# Altium project УШЯИ 687253.017 Э3.PrjPcb
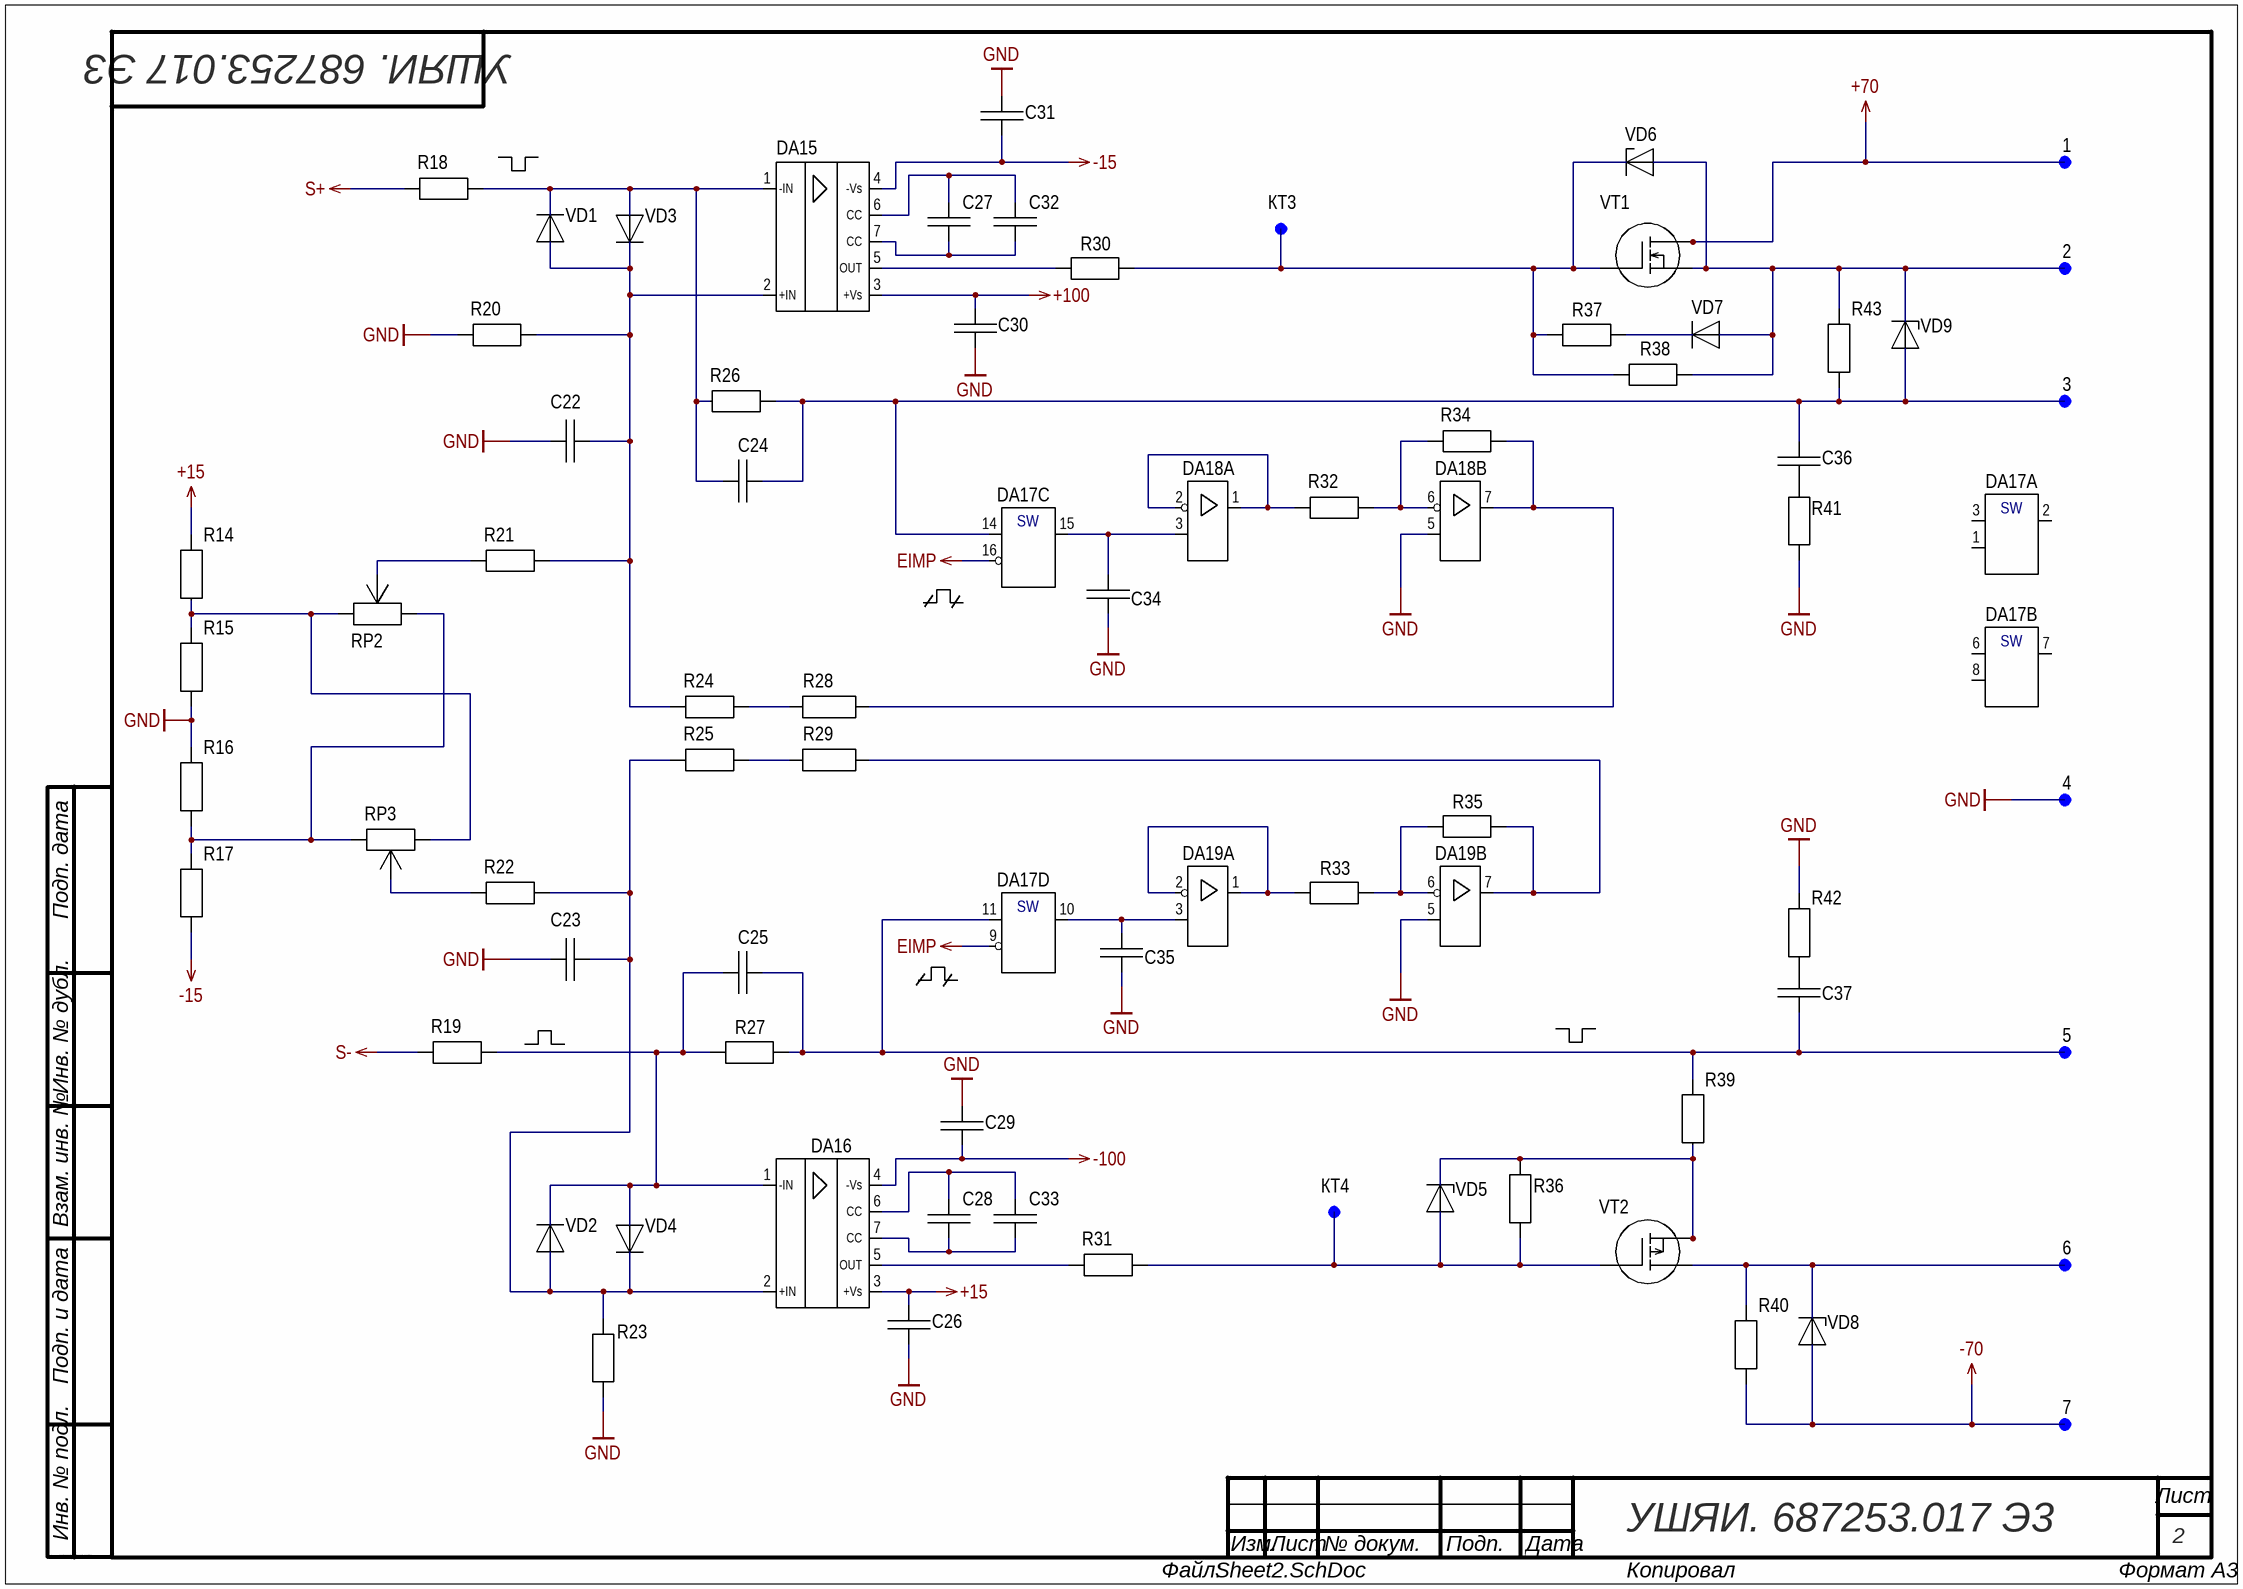
[diagram p0: Sheet2.SchDoc]
Вид_документа_SCH: Схема электрическая принципиальная; Наименование1: Плата; Обозначение_Код: УШЯИ. 687253.017 Э3; Характер_работы: Согл.; п_Доп_графа_Р: Голод; п_Пров_Р: Лисенков; п_Разраб_Р: Сидорик; п_Утв_Р: Грицев
2 sheets, 143 parts. Net scope: global (net labels, ports and power ports of the same name join across sheets).
Board files: PCB1.PcbDoc, PCB2.PcbDoc
Sheets:
  Sheet2.SchDoc
  Sheet3.SchDoc

## Sheet Sheet2.SchDoc
size 420 x 297 mm; SheetNumber: 2; SheetTotal: 3

### Parts
1  OTV  (value not drawn)
2  OTV  (value not drawn)
3  OTV  (value not drawn)
4  OTV  (value not drawn)
5  OTV  (value not drawn)
6  OTV  (value not drawn)
7  OTV  (value not drawn)
C22  2220-X7R-250 В-1 мкФ +-10%  [CAP: 2220]  (value not drawn)
C23  2220-X7R-250 В-1 мкФ +-10%  [CAP: 2220]  (value not drawn)
C24  0805-C0G-250 В-10 пФ +-5%  [CAP: 0805]  (value not drawn)
C25  0805-C0G-250 В-10 пФ +-5%  [CAP: 0805]  (value not drawn)
C26  0805-X7R-25 В-1 мкФ +-10%  [CAP: 0805]  (value not drawn)
C27  0805-C0G-250 В-10 пФ +-5%  [CAP: 0805]  (value not drawn)
C28  0805-C0G-250 В-10 пФ +-5%  [CAP: 0805]  (value not drawn)
C29  2220-X7R-250 В-1 мкФ +-10%  [CAP: 2220]  (value not drawn)
C30  2220-X7R-250 В-1 мкФ +-10%  [CAP: 2220]  (value not drawn)
C31  0805-X7R-25 В-1 мкФ +-10%  [CAP: 0805]  (value not drawn)
C32  0805-C0G-250 В-10 пФ +-5%  [CAP: 0805]  (value not drawn)
C33  0805-C0G-250 В-10 пФ +-5%  [CAP: 0805]  (value not drawn)
C34  К73-17-160 В-1 мкФ +-10%  [К73-17-A15]  (value not drawn)
C35  К73-17-160 В-1 мкФ +-10%  [К73-17-A15]  (value not drawn)
C36  1206-X7R-250 B-0,1 мкФ+-10%  [CAP: 1206]  (value not drawn)
C37  1206-X7R-250 B-0,1 мкФ+-10%  [CAP: 1206]  (value not drawn)
DA15  PA340CC  [D2PAK (TO263-7-1)]  (value not drawn)
DA16  PA340CC  [D2PAK (TO263-7-1)]  (value not drawn)
DA17  ADG433BR  [16-SOIC]  (value not drawn)  (parts A,B,C,D of 5)
DA18  AD823ARZ  [8-SOIC]  (value not drawn)  (parts A,B of 3)
DA19  AD823ARZ  [8-SOIC]  (value not drawn)  (parts A,B of 3)
R14  1206-15 кОм+-5%  [1206]  (value not drawn)
R15  1206-51 Ом+-5%  [1206]  (value not drawn)
R16  1206-51 Ом+-5%  [1206]  (value not drawn)
R17  1206-51 кОм+-5%  [1206]  (value not drawn)
R18  1206-2 кОм+-0.5%  [1206]  (value not drawn)
R19  1206-2 кОм+-0.5%  [1206]  (value not drawn)
R20  1206-2 кОм+-0.5%  [1206]  (value not drawn)
R21  1206-2 кОм+-0.5%  [1206]  (value not drawn)
R22  1206-2 кОм+-0.5%  [1206]  (value not drawn)
R23  1206-2 кОм+-0.5%  [1206]  (value not drawn)
R24  1206-10 кОм+-0,5%  [1206]  (value not drawn)
R25  1206-10 кОм+-0,5%  [1206]  (value not drawn)
R26  1206-20 кОм+-0.5%  [1206]  (value not drawn)
R27  1206-20 кОм+-0.5%  [1206]  (value not drawn)
R28  С2-33Н-0,125-1,5 кОм +-5%  [RES_AXIAL_VERTICAL_5mm]  (value not drawn)
R29  С2-33Н-0,125-1,5 кОм +-5%  [RES_AXIAL_VERTICAL_5mm]  (value not drawn)
R30  1206-2,4 кОм+-5%  [1206]  (value not drawn)
R31  1206-2,4 кОм+-5%  [1206]  (value not drawn)
R32  1206-20 кОм+-0.5%  [1206]  (value not drawn)
R33  1206-20 кОм+-0.5%  [1206]  (value not drawn)
R34  1206-20 кОм+-0.5%  [1206]  (value not drawn)
R35  1206-20 кОм+-0.5%  [1206]  (value not drawn)
R36  1206-2,4 кОм+-5%  [1206]  (value not drawn)
R37  1206-51 Ом+-5%  [1206]  (value not drawn)
R38  1206-2,4 кОм+-5%  [1206]  (value not drawn)
R39  1206-51 Ом+-5%  [1206]  (value not drawn)
R40  2512-51 Ом+-5%  [2512]  (value not drawn)
R41  2512-51 Ом+-5%  [2512]  (value not drawn)
R42  2512-51 Ом+-5%  [2512]  (value not drawn)
R43  2512-51 Ом+-5%  [2512]  (value not drawn)
RP2  PVG3A102C01R00  [PVG3A]  (value not drawn)
RP3  PVG3A102C01R00  [PVG3A]  (value not drawn)
VD1  1N4148  [DO-35 vertical]  (value not drawn)
VD2  1N4148  [DO-35 vertical]  (value not drawn)
VD3  1N4148  [DO-35 vertical]  (value not drawn)
VD4  1N4148  [DO-35 vertical]  (value not drawn)
VD5  BZX84C15LT1G  [SOT-23-3]  (value not drawn)
VD6  BZX84C15LT1G  [SOT-23-3]  (value not drawn)
VD7  1N4148  [DO-35 vertical]  (value not drawn)
VD8  BZX84C15LT1G  [SOT-23-3]  (value not drawn)
VD9  BZX84C15LT1G  [SOT-23-3]  (value not drawn)
VT1  ZXMN10A08E6TA  [SOT-23-6]  (value not drawn)
VT2  ZXMP10A17E6TA  [SOT-23-6]  (value not drawn)
КТ3  Lepestok  [LEPESTOK7750224]  (value not drawn)
КТ4  Lepestok  [LEPESTOK7750224]  (value not drawn)

### Nets
+15: C26.2 DA16.3(+Vs) R14.2
+70: 1.?1 VT1.1(D) VT1.2(D) VT1.5(D) VT1.6(D)
+100: C30.2 DA15.3(+Vs)
-15: C31.1 DA15.4(-Vs) R17.1
-70: 7.?1 R40.1 VD8.1
-100: C29.1 DA16.4(-Vs)
EIMP: DA17.9(IN3) DA17.16(IN2)
GND: 4.?1 C22.1 C23.1 C26.1 C29.2 C30.1 C31.2 C34.1 C35.1 DA18.5(+IN2) DA19.5(+IN2) R15.1 R16.2 R20.1 R23.1 R41.2 R42.2
S+: R18.1
S-: R19.1
Net2_?1: 2.?1 R38.2 R43.2 VD6.1 VD7.1 VD9.3 VT1.4(S)
Net3_?1: 3.?1 C24.2 C36.2 DA17.14(S2) R26.2 R43.1 VD9.1
Net5_?1: 5.?1 C25.2 C37.2 DA17.11(S3) R27.2 R39.2
Net6_?1: 6.?1 R40.2 VD8.3 VT2.4(S)
NetC22_2: C22.2 DA15.2(+IN) R20.2 R21.2 R24.1 VD1.1 VD3.2
NetC23_2: C23.2 DA16.2(+IN) R22.2 R23.2 R25.1 VD2.1 VD4.2
NetC24_1: C24.1 DA15.1(-IN) R18.2 R26.1 VD1.2 VD3.1
NetC25_1: C25.1 DA16.1(-IN) R19.2 R27.1 VD2.2 VD4.1
NetC27_1: C27.1 C32.1 DA15.7(СС)
NetC27_2: C27.2 C32.2 DA15.6(СС)
NetC28_1: C28.1 C33.1 DA16.7(СС)
NetC28_2: C28.2 C33.2 DA16.6(СС)
NetC34_2: C34.2 DA17.15(D2) DA18.3(+IN1)
NetC35_2: C35.2 DA17.10(D3) DA19.3(+IN1)
NetC36_1: C36.1 R41.1
NetC37_1: C37.1 R42.1
NetDA15_5: DA15.5(OUT) R30.1
NetDA16_5: DA16.5(OUT) R31.1
NetDA18_1: DA18.1(OUT1) DA18.2(-IN1) R32.1
NetDA18_6: DA18.6(-IN2) R32.2 R34.1
NetDA18_7: DA18.7(OUT2) R28.2 R34.2
NetDA19_1: DA19.1(OUT1) DA19.2(-IN1) R33.1
NetDA19_6: DA19.6(-IN2) R33.2 R35.1
NetDA19_7: DA19.7(OUT2) R29.2 R35.2
NetR14_1: R14.1 R15.2 RP2.3 RP3.3
NetR16_1: R16.1 R17.2 RP2.1 RP3.1
NetR21_1: R21.1 RP2.2(WIPER)
NetR22_1: R22.1 RP3.2(WIPER)
NetR24_2: R24.2 R28.1
NetR25_2: R25.2 R29.1
NetR30_2: R30.2 R37.1 R38.1 VD6.3 VT1.3(G) КТ3.1
NetR31_2: R31.2 R36.1 VD5.1 VT2.3(G) КТ4.1
NetR36_2: R36.2 R39.1 VD5.3 VT2.1(D) VT2.2(D) VT2.5(D) VT2.6(G)
NetR37_2: R37.2 VD7.2

Not connected (* = marked no-connect by the designer): DA17 1(IN1) 2(D1) 3(S1) 6(S4) 7(D4) 8(IN4)

### Notes on the sheet
- Подп. дата
- Инв. № дубл.
- Взам. инв. №
- Подп. и дата
- Инв. № подл.
- Изм.
- Лист
- № докум.
- Подп.
- Дата
- ALTIUM GOSTBOM2.0 KEV
- Файл:
- Копировал
- Формат А3
- (in symbol ADG433BR, part A) SW
- (in symbol ADG433BR, part B) SW
- (in symbol ADG433BR, part C) SW
- (in symbol ADG433BR, part D) SW

### Library data of the parts
C22 C23 C29 C30 = 2220-X7R-250 В-1 мкФ +-10%: Value: 1 мкФ
C24 C25 C27 C28 C32 C33 = 0805-C0G-250 В-10 пФ +-5%: Value: 10 пФ
C26 C31 = 0805-X7R-25 В-1 мкФ +-10%: Value: 1 мкФ
C36 C37 = 1206-X7R-250 B-0,1 мкФ+-10%: Value: 2,2 пФ
DA15 DA16 = PA340CC: High Voltage Power Operational Amplifier
DA17 = ADG433BR: LC2MOS Precision Quad SPST Switches; Value: *
DA18 DA19 = AD823ARZ: Dual, 16 MHz, Rail-to-Rail / FET Input Amplifier / 8-SOIC
R14 = 1206-15 кОм+-5%: Value: 15 кОм; ModelPrint: 1206
R15 R16 R37 R39 = 1206-51 Ом+-5%: Value: 51 Ом; ModelPrint: 1206
R17 = 1206-51 кОм+-5%: Value: 51 кОм; ModelPrint: 1206
R18-R23 = 1206-2 кОм+-0.5%: Value: 2 кОм; ModelPrint: 1206
R24 R25 = 1206-10 кОм+-0,5%: Value: 10 кОм; ModelPrint: 1206
R26 R27 R32-R35 = 1206-20 кОм+-0.5%: Value: 20 кОм; ModelPrint: 1206
R28 R29 = С2-33Н-0,125-1,5 кОм +-5%: Резисторы постоянные непроволочные общего применения С2-33Н АИ, производитель "АО"НПО"ЭРКОН"; Номинальная мощность рассеяния: 0,125 Вт; Диапазон значений номинальных сопротивлений: от 1 Ом до 3,01 МОм; Ряд сопротивлений: Е24, Е96; Категории качества: «ОТК»; ТУ: ОЖО.467.173 ТУ; Value: *
R30 R31 R36 R38 = 1206-2,4 кОм+-5%: Value: 2,4 кОм; ModelPrint: 1206
R40-R43 = 2512-51 Ом+-5%: Value: 51 Ом; ModelPrint: 2512
VD1-VD4 VD7 = 1N4148: Диод 1N4148; Value: *
VT1 = ZXMN10A08E6TA: MOSFET, N, SOT-23-6; Transistor Type: MOSFET; Transistor Polarity: N; Voltage, Vds Typ: 100V; Current, Id Cont: 1.5A;
VT2 = ZXMP10A17E6TA: P-Channel 100 V 0.35 Ohm Power MOSFET Surface Mount - SOT-23-6

## Sheet Sheet3.SchDoc
size 420 x 297 mm; SheetNumber: 3; SheetTotal: 3
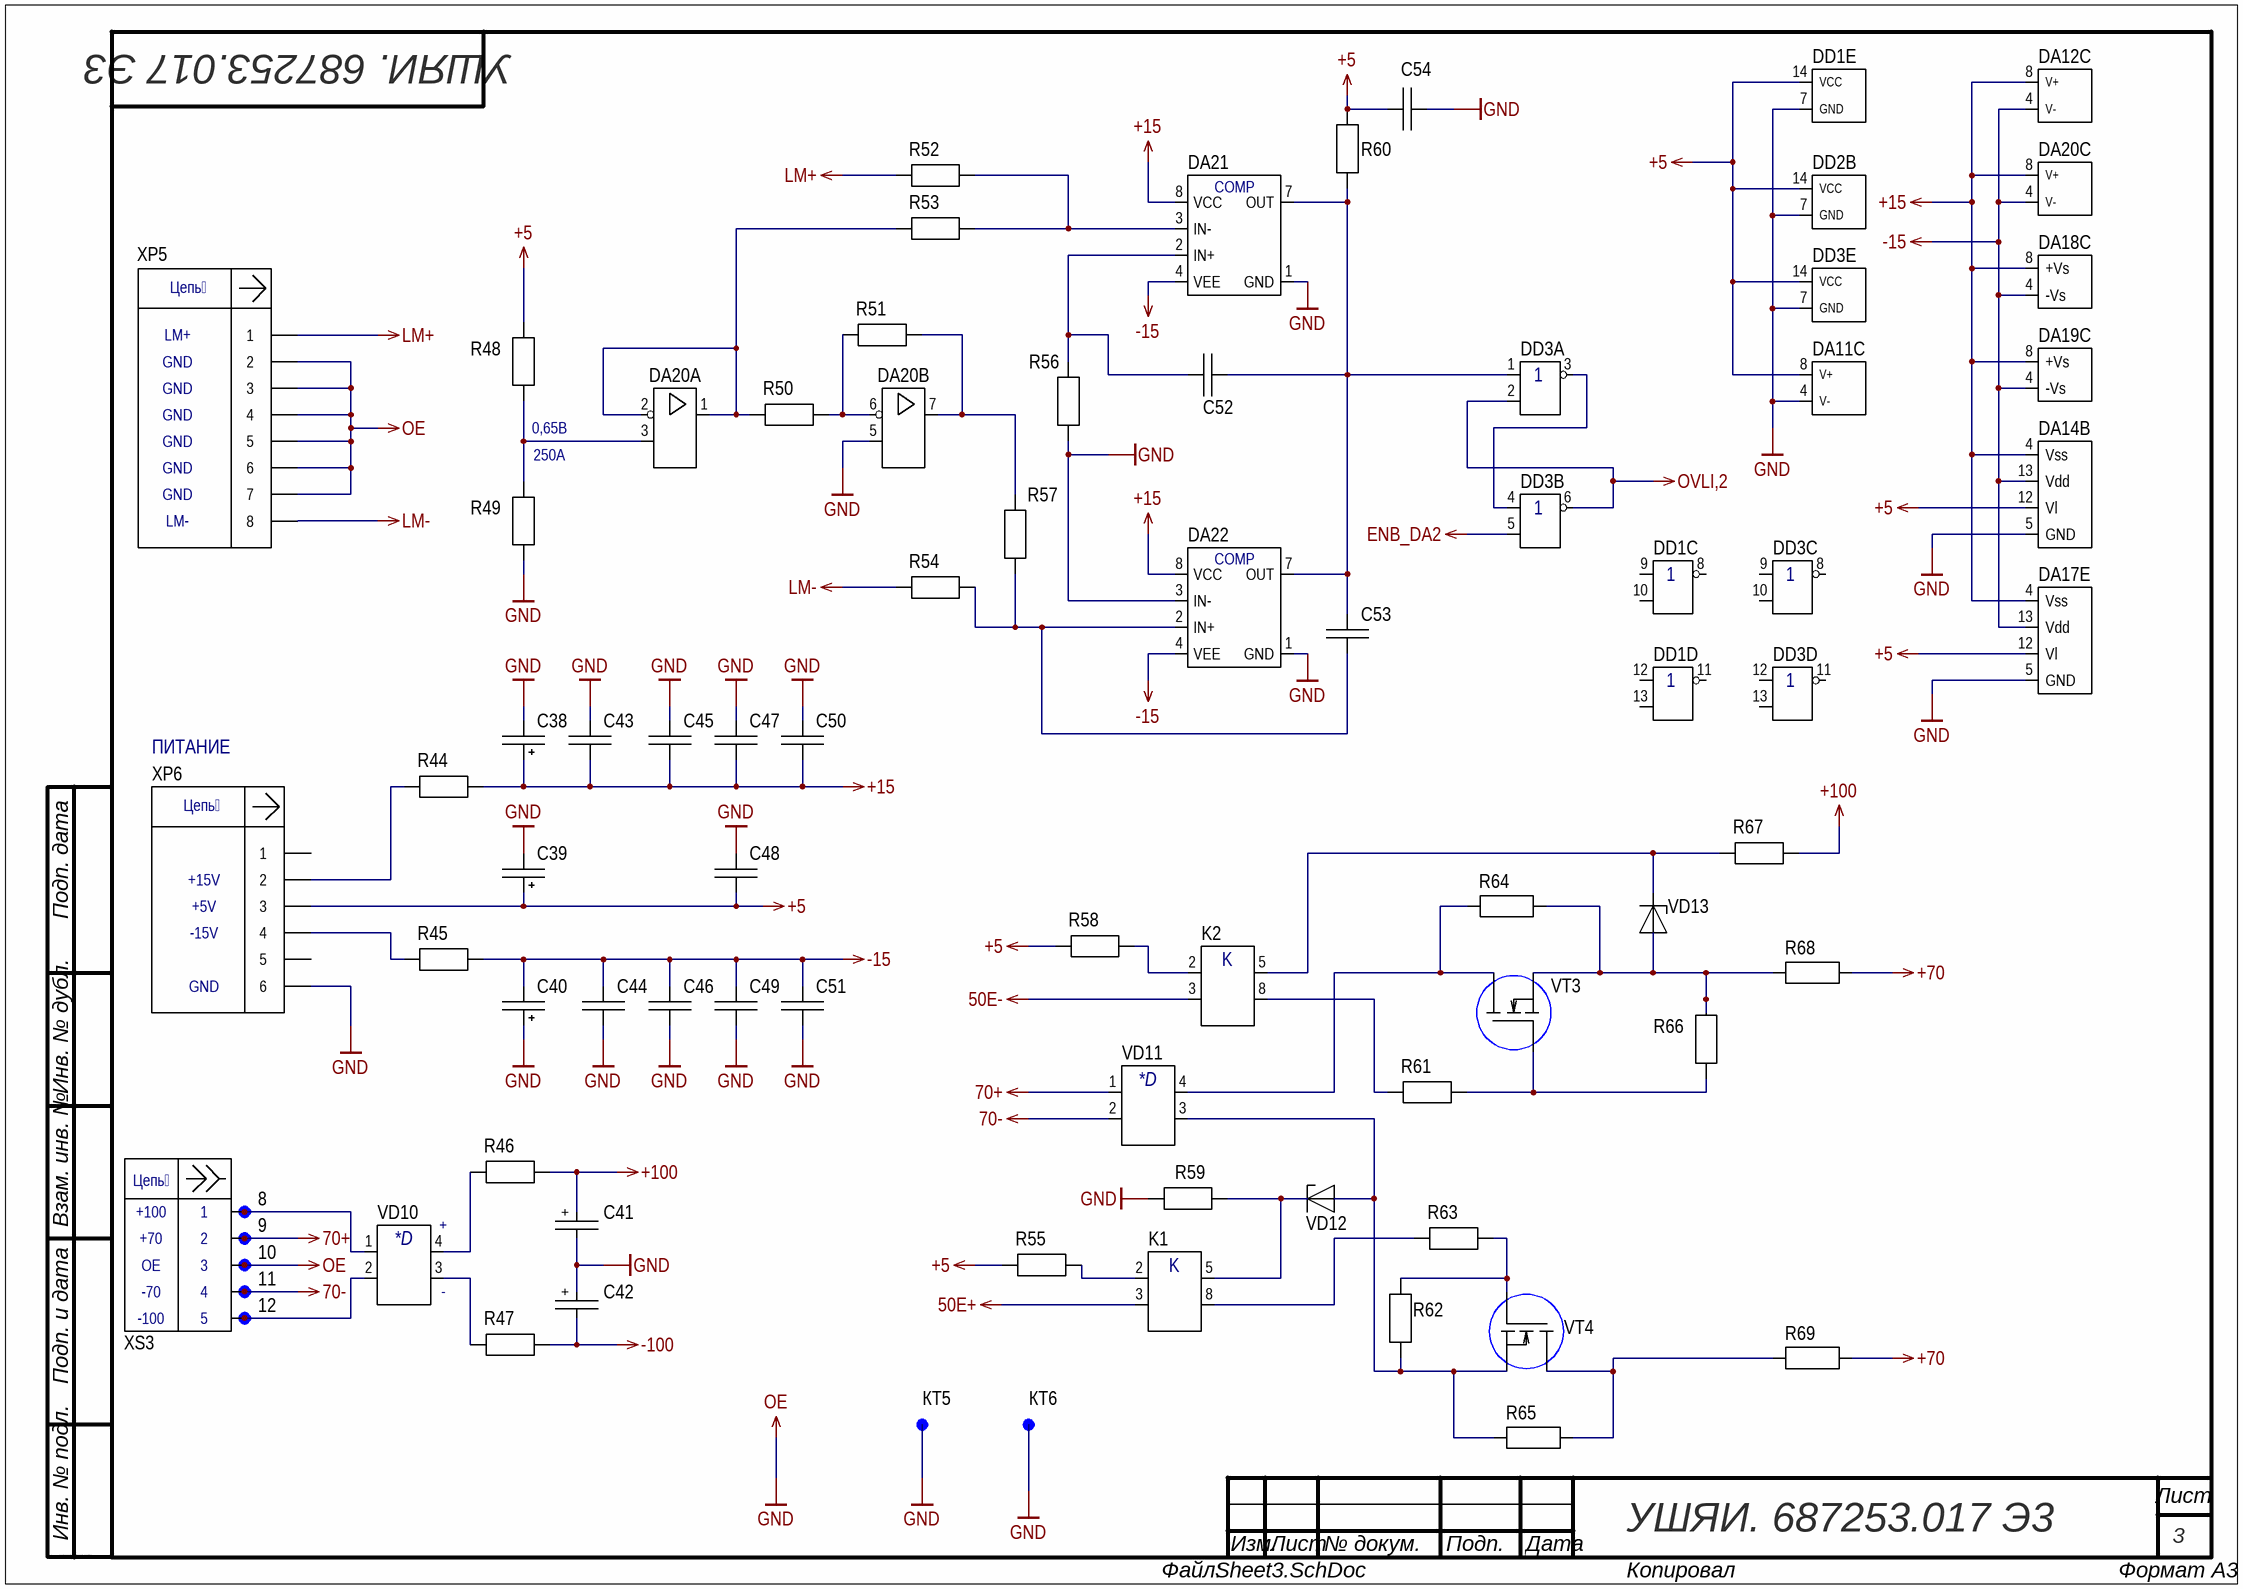
[diagram p1: Sheet3.SchDoc]

### Parts
8  OTV  (value not drawn)
9  OTV  (value not drawn)
10  OTV  (value not drawn)
11  OTV  (value not drawn)
12  OTV  (value not drawn)
C38  ECR4R7M50B  [CAP TH ALUM ELEC D5.00mm S2.00mm H11.00mm]  (value not drawn)
C39  ECR4R7M50B  [CAP TH ALUM ELEC D5.00mm S2.00mm H11.00mm]  (value not drawn)
C40  ECR4R7M50B  [CAP TH ALUM ELEC D5.00mm S2.00mm H11.00mm]  (value not drawn)
C41  EHR-250B-47 мкФ  [CAP TH ALUM ELEC D13.00mm S5.00mm H26.50mm]  (value not drawn)
C42  EHR-250B-47 мкФ  [CAP TH ALUM ELEC D13.00mm S5.00mm H26.50mm]  (value not drawn)
C43  0805-X7R-25 В-0,33 мкФ +-10%  [CAP: 0805]  (value not drawn)
C44  0805-X7R-25 В-0,33 мкФ +-10%  [CAP: 0805]  (value not drawn)
C45  0805-X7R-25 В-0,33 мкФ +-10%  [CAP: 0805]  (value not drawn)
C46  0805-X7R-25 В-0,33 мкФ +-10%  [CAP: 0805]  (value not drawn)
C47  0805-X7R-25 В-0,33 мкФ +-10%  [CAP: 0805]  (value not drawn)
C48  0805-X7R-25 В-0,33 мкФ +-10%  [CAP: 0805]  (value not drawn)
C49  0805-X7R-25 В-0,33 мкФ +-10%  [CAP: 0805]  (value not drawn)
C50  0805-X7R-25 В-0,33 мкФ +-10%  [CAP: 0805]  (value not drawn)
C51  0805-X7R-25 В-0,33 мкФ +-10%  [CAP: 0805]  (value not drawn)
C52  1206-X7R-50 B-22 пФ+-10%  [CAP: 1206]  (value not drawn)
C53  1206-X7R-50 B-22 пФ+-10%  [CAP: 1206]  (value not drawn)
C54  0805-X7R-25 В-0,33 мкФ +-10%  [CAP: 0805]  (value not drawn)
DA11  ADA4084-2ARZ  [8-SOIC]  (value not drawn)  (part C of 3)
DA12  ADA4084-2ARZ  [8-SOIC]  (value not drawn)  (part C of 3)
DA14  ADG433BR  [16-SOIC]  (value not drawn)  (part B of 2)
DA17  ADG433BR  [16-SOIC]  (value not drawn)  (part E of 5)
DA18  AD823ARZ  [8-SOIC]  (value not drawn)  (part C of 3)
DA19  AD823ARZ  [8-SOIC]  (value not drawn)  (part C of 3)
DA20  ADA4084-2ARZ  [8-SOIC]  (value not drawn)  (parts A,B,C of 3)
DA21  IL311D  [8-SOIC]  (value not drawn)
DA22  IL311D  [8-SOIC]  (value not drawn)
DD1  IN74HC00AD  [14-soic]  (value not drawn)  (parts C,D,E of 5)
DD2  IN74HC20D  [14-SOIC]  (value not drawn)  (part B of 2)
DD3  IN74HC00AD  [14-soic]  (value not drawn)  (parts A,B,C,D,E of 5)
K1  TLP3549F  [8-DIP]  (value not drawn)
K2  TLP3549F  [8-DIP]  (value not drawn)
R44  1206-2,2 Ом+-5%  [1206]  (value not drawn)
R45  1206-2,2 Ом+-5%  [1206]  (value not drawn)
R46  2512-1,2 кОм+-5%  [2512]  (value not drawn)
R47  2512-1,2 кОм+-5%  [2512]  (value not drawn)
R48  1206-6,98 кОм+-1%  [1206]  (value not drawn)
R49  1206-1 кОм+-5%  [1206]  (value not drawn)
R50  1206-2 кОм+-0.5%  [1206]  (value not drawn)
R51  1206-2 кОм+-0.5%  [1206]  (value not drawn)
R52  1206-240 Ом+-5%  [1206]  (value not drawn)
R53  1206-240 Ом+-5%  [1206]  (value not drawn)
R54  1206-240 Ом+-5%  [1206]  (value not drawn)
R55  1206-430 Ом+-5%  [1206]  (value not drawn)
R56  1206-150 Ом+-5%  [1206]  (value not drawn)
R57  1206-240 Ом+-5%  [1206]  (value not drawn)
R58  1206-430 Ом+-5%  [1206]  (value not drawn)
R59  2512-5,6 кОм+-5%  [2512]  (value not drawn)
R60  1206-2 кОм+-5%  [1206]  (value not drawn)
R61  1206-390 Ом+-5%  [1206]  (value not drawn)
R62  1206-51 кОм+-5%  [1206]  (value not drawn)
R63  1206-390 Ом+-5%  [1206]  (value not drawn)
R64  W21-3W-680 Ом +-5%  [RES_AXIAL_VERTICAL_5mm]  (value not drawn)
R65  W21-3W-680 Ом +-5%  [RES_AXIAL_VERTICAL_5mm]  (value not drawn)
R66  1206-51 кОм+-5%  [1206]  (value not drawn)
R67  1206-2,7 кОм+-5%  [1206]  (value not drawn)
R68  HS15-4R7-J  [HS15]  (value not drawn)
R69  HS15-4R7-J  [HS15]  (value not drawn)
VD10  W04M  [WOM]  (value not drawn)
VD11  GSIB2540  [GSIB-5S]  (value not drawn)
VD12  BZX79-C10V  [DO-35 vertical]  (value not drawn)
VD13  BZX79-C10V  [DO-35 vertical]  (value not drawn)
VT3  IPA083N10N5XKSA1  [TO-220_HV_FET]  (value not drawn)
VT4  IPA083N10N5XKSA1  [TO-220_HV_FET]  (value not drawn)
XP5  280373-2  [280373-2]  (value not drawn)
XP6  280372-2  [280372-2]  (value not drawn)
XS3  MNL-350810-1  (value not drawn)
КТ5  Lepestok  [LEPESTOK7750224]  (value not drawn)
КТ6  Lepestok  [LEPESTOK7750224]  (value not drawn)

### Nets
50E+: K1.3(KATHODE)
50E-: K2.3(KATHODE)
70+: 9.?1 VD11.1 XS3.2
70-: 11.?1 VD11.2 XS3.4
+5: C39.1 C48.2 C54.1 DA11.8(V+) DA14.12(Vl) DA17.12(Vl) DD1.14(VCC) DD2.14(VCC) DD3.14(VCC) R48.2 R55.1 R58.2 R60.2 XP6.3
+15: C38.1 C43.1 C45.2 C47.2 C50.2 DA12.8(V+) DA14.4(Vss) DA17.4(Vss) DA18.8(+Vs) DA19.8(+Vs) DA20.8(V+) DA21.8(VCC) DA22.8(VCC) R44.1
+70: R68.2 R69.2
+100: C41.2 R46.2 R67.1
-15: C40.2 C44.1 C46.1 C49.1 C51.1 DA12.4(V-) DA14.13(Vdd) DA17.13(Vdd) DA18.4(-Vs) DA19.4(-Vs) DA20.4(V-) DA21.4(VEE) DA22.4(VEE) R45.1
-100: C42.1 R47.2
ENB_DA2: DD3.5(B2)
GND: 10.?1 C38.2 C39.2 C40.1 C41.1 C42.2 C43.2 C44.2 C45.1 C46.2 C47.1 C48.1 C49.2 C50.1 C51.2 C54.2 DA11.4(V-) DA14.5(GND) DA17.5(GND) DA20.5(+IN_B) DA21.1(GND) DA22.1(GND) DA22.3(IN-) DD1.7(GND) DD2.7(GND) DD3.7(GND) R49.1 R56.1 R59.1 XP5.2 XP5.3 XP5.4 XP5.5 XP5.6 XP5.7 XP6.6 XS3.3 КТ5.1 КТ6.1  [also labelled OE]
LM+: R52.1 XP5.1
LM-: R54.2 XP5.8
OVLI,2: DD3.2(B1) DD3.6(Y2)
Net8_?1: 8.?1 VD10.1 XS3.1
Net12_?1: 12.?1 VD10.2 XS3.5
NetC52_1: C52.1 C53.2 DA21.7(OUT) DA22.7(OUT) DD3.1(A1) R60.1
NetC52_2: C52.2 DA21.2(IN+) R56.2
NetC53_1: C53.1 DA22.2(IN+) R54.1 R57.1
NetDA20_1: DA20.1(OUT_A) DA20.2(-IN_A) R50.1 R53.1
NetDA20_3: DA20.3(+IN_A) R48.1 R49.2
NetDA20_6: DA20.6(-IN_B) R50.2 R51.1
NetDA20_7: DA20.7(OUT_B) R51.2 R57.2
NetDA21_3: DA21.3(IN-) R52.2 R53.2
NetDD3_3: DD3.3(Y1) DD3.4(A2)
NetK1_2: K1.2(ANOD) R55.2
NetK1_5: K1.5(DRAIN) R59.2 VD12.2
NetK1_8: K1.8(DRAIN) R63.1
NetK2_2: K2.2(ANOD) R58.1
NetK2_5: K2.5(DRAIN) R67.2 VD13.2
NetK2_8: K2.8(DRAIN) R61.1
NetR44_2: R44.2 XP6.2
NetR45_2: R45.2 XP6.4
NetR46_1: R46.1 VD10.4
NetR47_1: R47.1 VD10.3
NetR61_2: R61.2 R66.1 VT3.1(G)
NetR62_1: R62.1 R65.1 VD11.3 VD12.1 VT4.3(S)
NetR62_2: R62.2 R63.2 VT4.1(G)
NetR64_1: R64.1 VD11.4 VT3.2(D)
NetR64_2: R64.2 R66.2 R68.1 VD13.1 VT3.3(S)
NetR65_2: R65.2 R69.1 VT4.2(D)

Not connected (* = marked no-connect by the designer): DD1 8(Y3) 9(A3) 10(B3) 11(Y4) 12(A4) 13(B4); DD3 8(Y3) 9(A3) 10(B3) 11(Y4) 12(A4) 13(B4); XP6 1 5

### Notes on the sheet
- LM+
- GND
- (near R48) 0,65В
- (near R49) 250А
- LM-
- ПИТАНИЕ
- +15V
- +5V
- -15V
- +100
- 1
- +70
- OE
- 2
- 3
- (near VD10) +
- -70
- -100
- 4
- 5
- (near VD10) -
- Подп. дата
- Инв. № дубл.
- Взам. инв. №
- Подп. и дата
- Инв. № подл.
- Изм.
- Лист
- № докум.
- Подп.
- Дата
- ALTIUM GOSTBOM2.0 KEV
- Файл:
- Копировал
- Формат А3
- (in symbol 280372-2) Цепь
- (in symbol 280373-2) Цепь
- (in symbol EHR-250B-47 мкФ) +
- (in symbol GSIB2540) *D
- (in symbol IL311D) COMP
- (in symbol MNL-350810-1) Цепь
- (in symbol TLP3549F) K
- (in symbol W04M) *D

### Library data of the parts
C38-C40 = ECR4R7M50B: Value: 4,7 мкФ
C41 C42 = EHR-250B-47 мкФ: EHR-250B-47 мкФ, 105C,13x26; Value: *
C52 C53 = 1206-X7R-50 B-22 пФ+-10%: Value: 2,2 пФ
DA11 DA12 DA20 = ADA4084-2ARZ: 30 V, Low Noise, Rail-to-Rail Input/Output, / Low Power Operational Amplifiers
DA14 = ADG433BR_1: LC2MOS Precision Quad SPST Switches; Value: *
DA17 = ADG433BR: LC2MOS Precision Quad SPST Switches; Value: *
DA18 DA19 = AD823ARZ: as DA18 on sheet Sheet2
DA21 DA22 = IL311D: High Perfomance Voltage Comparartor; Value: *
DD1 DD3 = IN74HC00AD: Quad 2-Input NAND Gate High-Performance Silicon-Gate CMOS.
DD2 = IN74HC20D_1: Dual 4-input  NAND Gate CMOS
R44 R45 = 1206-2,2 Ом+-5%: Value: 2,2 кОм; ModelPrint: 1206
R46 R47 = 2512-1,2 кОм+-5%: Value: 1,2 кОм; ModelPrint: 2512
R49 = 1206-1 кОм+-5%: Value: 1 кОм; ModelPrint: 1206
R50 R51 = 1206-2 кОм+-0.5%: Value: 2 кОм; ModelPrint: 1206
R52-R54 R57 = 1206-240 Ом+-5%: Value: 240 Ом; ModelPrint: 1206
R55 R58 = 1206-430 Ом+-5%: Value: 430 Ом; ModelPrint: 1206
R56 = 1206-150 Ом+-5%: Value: 150 Ом; ModelPrint: 1206
R59 = 2512-5,6 кОм+-5%: Value: 5,6 кОм; ModelPrint: 2512
R60 = 1206-2 кОм+-5%: Value: 2 кОм; ModelPrint: 1206
R61 R63 = 1206-390 Ом+-5%: Value: 390 Ом; ModelPrint: 1206
R62 R66 = 1206-51 кОм+-5%: Value: 51 кОм; ModelPrint: 1206
R64 R65 = W21-3W-680 Ом +-5%: Номинальная мощность рассеяния: 0,125 Вт; Диапазон значений номинальных сопротивлений: от 1 Ом до 3,01 МОм; Ряд сопротивлений: Е24, Е96; Категории качества: «ОТК»; ТУ: ОЖО.467.173 ТУ; Value: *
R67 = 1206-2,7 кОм+-5%: Value: 2,7 кОм; ModelPrint: 1206
R68 R69 = HS15-4R7-J: Номинальная мощность рассеяния: 0,25 Вт; Диапазон значений номинальных сопротивлений: от 0,1 Ом до 3,01 МОм; Ряд сопротивлений: Е24, Е96; Категории качества: «ОТК»; ТУ: ОЖО.467.173 ТУ; Value: 4,7 Ом
VD10 = W04M: Диод W04M
VD11 = GSIB2540: Диод GSIB2540
VD12 VD13 = BZX79-C10V: Стабилитрон BZX79-C10V; Value: *
VT3 VT4 = IPA083N10N5XKSA1: Single N-Channel 100 V 8.3 mOhm 37 nC OptiMOS Power Mosfet - TO-220-3
XP5 = 280373-2: Connector
XP6 = 280372-2: Connector
C43-C51 C54 = 0805-X7R-25 В-0,33 мкФ +-10%: Value: 0,33 мкФ
R48 = 1206-6,98 кОм+-1%: Value: 6,98 кОм; ModelPrint: 1206

## Nets that join several sheets
+15: Sheet2 (C26.2 DA16.3 R14.2), Sheet3 (14 pins)
+70: Sheet2 (5 pins), Sheet3 (R68.2 R69.2)
+100: Sheet2 (C30.2 DA15.3), Sheet3 (C41.2 R46.2 R67.1)
-15: Sheet2 (C31.1 DA15.4 R17.1), Sheet3 (14 pins)
-100: Sheet2 (C29.1 DA16.4), Sheet3 (C42.1 R47.2)
GND: Sheet2 (17 pins), Sheet3 (39 pins)